# EAGLE schematic mcb-enhancer-v4 (EAGLE 6.3)
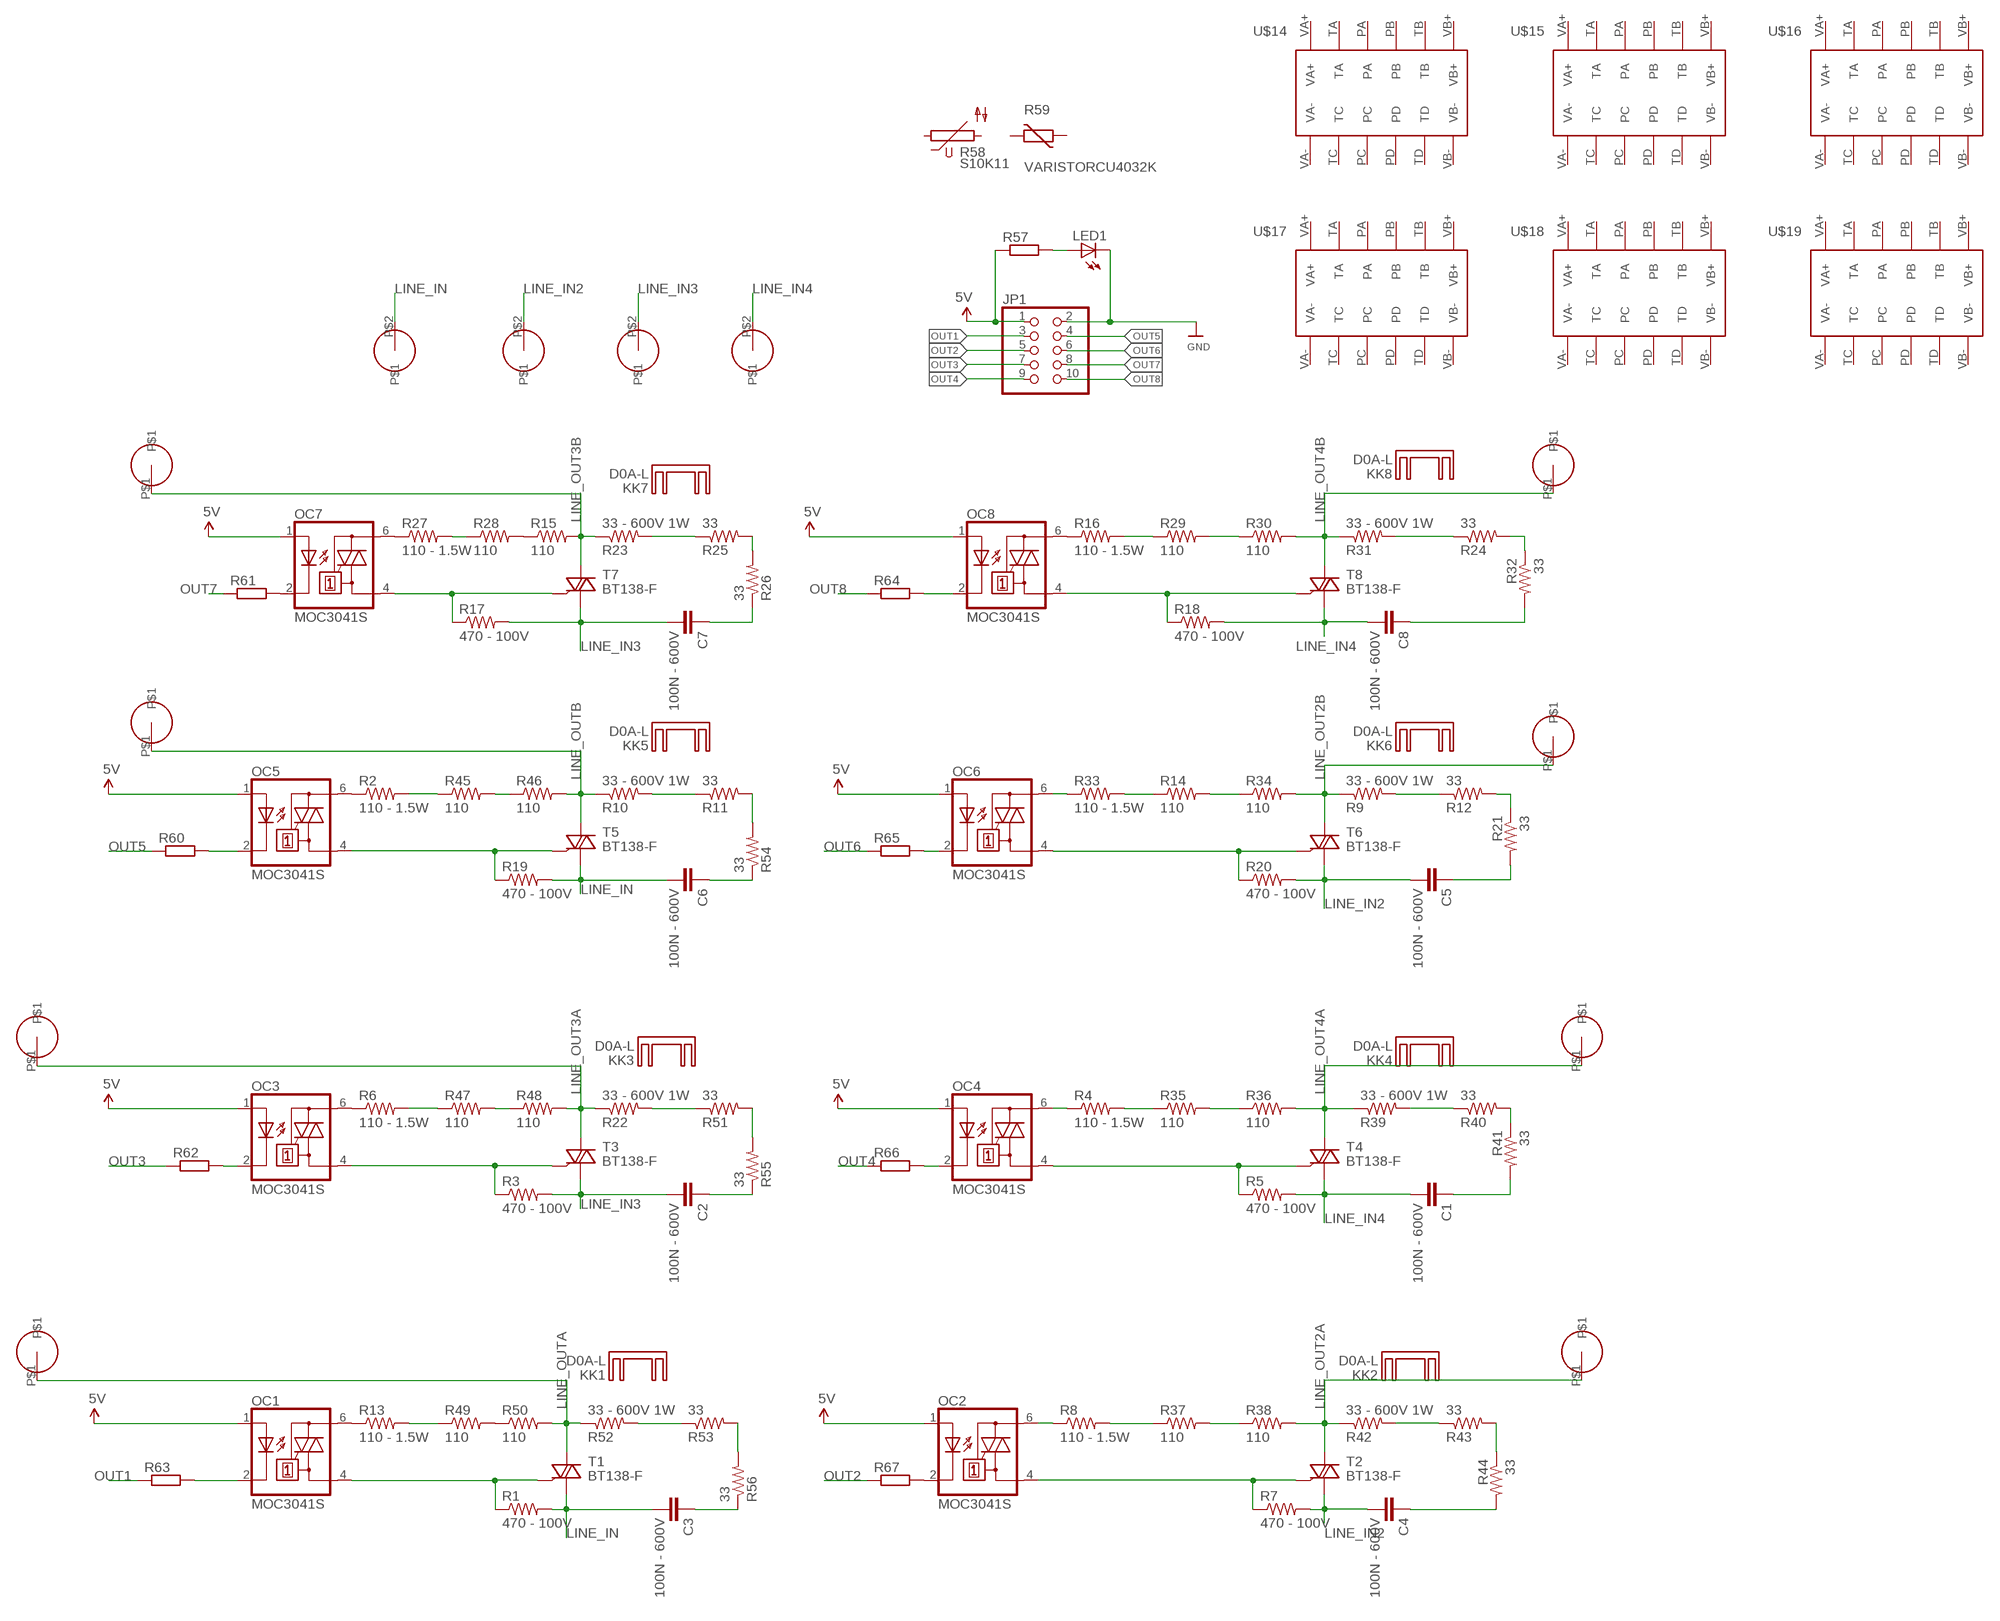
[diagram p0: schematic, sheet 1]

## Parts
C1  100N - 600V  C-EUC1210  [C1210]
C2  100N - 600V  C-EUC1210  [C1210]
C3  100N - 600V  C-EUC1210  [C1210]
C4  100N - 600V  C-EUC1210  [C1210]
C5  100N - 600V  C-EUC1210  [C1210]
C6  100N - 600V  C-EUC1210  [C1210]
C7  100N - 600V  C-EUC1210  [C1210]
C8  100N - 600V  C-EUC1210  [C1210]
JP1  PINHD-2X5  [2X05]
KK1  D0A-L  [D02A-L]
KK2  D0A-L  [D02A-L]
KK3  D0A-L  [D02A-L]
KK4  D0A-L  [D02A-L]
KK5  D0A-L  [D02A-L]
KK6  D0A-L  [D02A-L]
KK7  D0A-L  [D02A-L]
KK8  D0A-L  [D02A-L]
LED1  LEDCHIP-LED0805  [CHIP-LED0805]
OC1  MOC3041S  [DIL6-SMD]
OC2  MOC3041S  [DIL6-SMD]
OC3  MOC3041S  [DIL6-SMD]
OC4  MOC3041S  [DIL6-SMD]
OC5  MOC3041S  [DIL6-SMD]
OC6  MOC3041S  [DIL6-SMD]
OC7  MOC3041S  [DIL6-SMD]
OC8  MOC3041S  [DIL6-SMD]
R1  470 - 100V  R-US_R1206  [R1206]
R2  110 - 1.5W  R-US_R2512  [R2512]
R3  470 - 100V  R-US_R1206  [R1206]
R4  110 - 1.5W  R-US_R2512  [R2512]
R5  470 - 100V  R-US_R1206  [R1206]
R6  110 - 1.5W  R-US_R2512  [R2512]
R7  470 - 100V  R-US_R1206  [R1206]
R8  110 - 1.5W  R-US_R2512  [R2512]
R9  33 - 600V 1W  R-US_R1206  [R1206]
R10  33 - 600V 1W  R-US_R1206  [R1206]
R11  33  R-US_R1206  [R1206]
R12  33  R-US_R1206  [R1206]
R13  110 - 1.5W  R-US_R2512  [R2512]
R14  110  R-US_R2512  [R2512]
R15  110  R-US_R2512  [R2512]
R16  110 - 1.5W  R-US_R2512  [R2512]
R17  470 - 100V  R-US_R1206  [R1206]
R18  470 - 100V  R-US_R1206  [R1206]
R19  470 - 100V  R-US_R1206  [R1206]
R20  470 - 100V  R-US_R1206  [R1206]
R21  33  R-US_R1206  [R1206]
R22  33 - 600V 1W  R-US_R1206  [R1206]
R23  33 - 600V 1W  R-US_R1206  [R1206]
R24  33  R-US_R1206  [R1206]
R25  33  R-US_R1206  [R1206]
R26  33  R-US_R1206  [R1206]
R27  110 - 1.5W  R-US_R2512  [R2512]
R28  110  R-US_R2512  [R2512]
R29  110  R-US_R2512  [R2512]
R30  110  R-US_R2512  [R2512]
R31  33 - 600V 1W  R-US_R1206  [R1206]
R32  33  R-US_R1206  [R1206]
R33  110 - 1.5W  R-US_R2512  [R2512]
R34  110  R-US_R2512  [R2512]
R35  110  R-US_R2512  [R2512]
R36  110  R-US_R2512  [R2512]
R37  110  R-US_R2512  [R2512]
R38  110  R-US_R2512  [R2512]
R39  33 - 600V 1W  R-US_R1206  [R1206]
R40  33  R-US_R1206  [R1206]
R41  33  R-US_R1206  [R1206]
R42  33 - 600V 1W  R-US_R1206  [R1206]
R43  33  R-US_R1206  [R1206]
R44  33  R-US_R1206  [R1206]
R45  110  R-US_R2512  [R2512]
R46  110  R-US_R2512  [R2512]
R47  110  R-US_R2512  [R2512]
R48  110  R-US_R2512  [R2512]
R49  110  R-US_R2512  [R2512]
R50  110  R-US_R2512  [R2512]
R51  33  R-US_R1206  [R1206]
R52  33 - 600V 1W  R-US_R1206  [R1206]
R53  33  R-US_R1206  [R1206]
R54  33  R-US_R1206  [R1206]
R55  33  R-US_R1206  [R1206]
R56  33  R-US_R1206  [R1206]
R57  R-EU_R0402  [R0402]
R58  S10K11  [S10K11]
R59  VARISTORCU4032K  [CU4032K]
R60  R-EU_R0603  [R0603]
R61  R-EU_R0603  [R0603]
R62  R-EU_R0603  [R0603]
R63  R-EU_R0603  [R0603]
R64  R-EU_R0603  [R0603]
R65  R-EU_R0603  [R0603]
R66  R-EU_R0603  [R0603]
R67  R-EU_R0603  [R0603]
T1  BT138-F  [TO220BF]
T2  BT138-F  [TO220BF]
T3  BT138-F  [TO220BF]
T4  BT138-F  [TO220BF]
T5  BT138-F  [TO220BF]
T6  BT138-F  [TO220BF]
T7  BT138-F  [TO220BF]
T8  BT138-F  [TO220BF]
U$1  CONN-SCREW-MINI  [CONN-SCREW-MINI]
U$2  CONN-SCREW-MINI  [CONN-SCREW-MINI]
U$3  CONN-SCREW-MINI  [CONN-SCREW-MINI]
U$4  CONN-SCREW-MINI  [CONN-SCREW-MINI]
U$5  CONN-SCREW-MINI  [CONN-SCREW-MINI]
U$6  CONN-SCREW-MINI  [CONN-SCREW-MINI]
U$7  CONN-SCREW-MINI  [CONN-SCREW-MINI]
U$8  CONN-SCREW-MINI  [CONN-SCREW-MINI]
U$9  CONN  [HC617]
U$10  CONN  [HC617]
U$11  CONN  [HC617]
U$12  CONN  [HC617]
U$14  S4EB-5V  [S4EB-5V]
U$15  S4EB-5V  [S4EB-5V]
U$16  S4EB-5V  [S4EB-5V]
U$17  S4EB-5V  [S4EB-5V]
U$18  S4EB-5V  [S4EB-5V]
U$19  S4EB-5V  [S4EB-5V]

## Nets
5V: JP1.1 OC1.1(A) OC2.1(A) OC3.1(A) OC4.1(A) OC5.1(A) OC6.1(A) OC7.1(A) OC8.1(A) R57.1
GND: JP1.2 LED1.C
LINE_IN: C3.2 C6.2 R1.2 R19.2 T1.T1(A1) T5.T1(A1) U$9.P$2
LINE_IN2: C4.2 C5.2 R7.2 R20.2 T2.T1(A1) T6.T1(A1) U$10.P$2
LINE_IN3: C2.2 C7.2 R3.2 R17.2 T3.T1(A1) T7.T1(A1) U$11.P$2
LINE_IN4: C1.2 C8.2 R5.2 R18.2 T4.T1(A1) T8.T1(A1) U$12.P$2
LINE_OUT2A: R38.2 R42.1 T2.T2(A2) U$2.P$1
LINE_OUT2B: R9.1 R34.2 T6.T2(A2) U$6.P$1
LINE_OUT3A: R22.1 R48.2 T3.T2(A2) U$3.P$1
LINE_OUT3B: R15.2 R23.1 T7.T2(A2) U$7.P$1
LINE_OUT4A: R36.2 R39.1 T4.T2(A2) U$4.P$1
LINE_OUT4B: R30.2 R31.1 T8.T2(A2) U$8.P$1
LINE_OUTA: R50.2 R52.1 T1.T2(A2) U$1.P$1
LINE_OUTB: R10.1 R46.2 T5.T2(A2) U$5.P$1
N$1: OC5.6(A2) R2.1
N$2: OC2.6(A2) R8.1
N$3: OC3.4(A1) R3.1 T3.G
N$4: OC3.6(A2) R6.1
N$5: OC4.4(A1) R5.1 T4.G
N$6: OC1.2(C) R63.2
N$7: R9.2 R12.1
N$8: R49.2 R50.1
N$9: R52.2 R53.1
N$10: OC1.6(A2) R13.1
N$11: OC1.4(A1) R1.1 T1.G
N$12: R8.2 R37.1
N$13: OC2.4(A1) R7.1 T2.G
N$14: R45.2 R46.1
N$15: OC2.2(C) R67.2
N$16: R23.2 R25.1
N$17: R25.2 R26.2
N$18: OC3.2(C) R62.2
N$19: OC4.2(C) R66.2
N$20: C7.1 R26.1
N$21: R12.2 R21.1
N$22: OC7.2(C) R61.2
N$23: OC7.6(A2) R27.1
N$24: OC8.2(C) R64.2
N$25: R15.1 R28.2
N$26: R27.2 R28.1
N$27: OC5.2(C) R60.2
N$28: OC6.2(C) R65.2
N$29: R16.2 R29.1
N$30: OC7.4(A1) R17.1 T7.G
N$31: OC8.6(A2) R16.1
N$32: OC8.4(A1) R18.1 T8.G
N$33: R29.2 R30.1
N$34: R37.2 R38.1
N$35: OC5.4(A1) R19.1 T5.G
N$36: OC6.4(A1) R20.1 T6.G
N$37: C5.1 R21.2
N$38: OC4.6(A2) R4.1
N$39: C8.1 R32.2
N$40: R24.2 R32.1
N$41: R24.1 R31.2
N$42: R4.2 R35.1
N$43: R35.2 R36.1
N$44: OC6.6(A2) R33.1
N$45: R14.1 R33.2
N$46: R14.2 R34.1
N$47: R39.2 R40.1
N$48: C1.1 R41.2
N$49: R40.2 R41.1
N$50: C4.1 R44.2
N$51: R43.2 R44.1
N$52: R42.2 R43.1
N$53: R47.2 R48.1
N$54: R13.2 R49.1
N$55: R6.2 R47.1
N$56: R2.2 R45.1
N$57: R22.2 R51.1
N$58: R10.2 R11.1
N$59: C3.1 R56.1
N$60: R53.2 R56.2
N$61: C2.1 R55.1
N$62: R51.2 R55.2
N$63: C6.1 R54.1
N$64: R11.2 R54.2
N$65: LED1.A R57.2
OUT1: JP1.3 R63.1
OUT2: JP1.5 R67.1
OUT3: JP1.7 R62.1
OUT4: JP1.9 R66.1
OUT5: JP1.4 R60.1
OUT6: JP1.6 R65.1
OUT7: JP1.8 R61.1
OUT8: JP1.10 R64.1
Unconnected: R58.1 R58.2 R59.1 R59.2 U$14.PA U$14.PB U$14.PC U$14.PD U$14.TA U$14.TB U$14.TC U$14.TD U$14.VA+ U$14.VA- U$14.VB+ U$14.VB- U$15.PA U$15.PB U$15.PC U$15.PD U$15.TA U$15.TB U$15.TC U$15.TD U$15.VA+ U$15.VA- U$15.VB+ U$15.VB- U$16.PA U$16.PB U$16.PC U$16.PD U$16.TA U$16.TB U$16.TC U$16.TD U$16.VA+ U$16.VA- U$16.VB+ U$16.VB- U$17.PA U$17.PB U$17.PC U$17.PD U$17.TA U$17.TB U$17.TC U$17.TD U$17.VA+ U$17.VA- U$17.VB+ U$17.VB- U$18.PA U$18.PB U$18.PC U$18.PD U$18.TA U$18.TB U$18.TC U$18.TD U$18.VA+ U$18.VA- U$18.VB+ U$18.VB- U$19.PA U$19.PB U$19.PC U$19.PD U$19.TA U$19.TB U$19.TC U$19.TD U$19.VA+ U$19.VA- U$19.VB+ U$19.VB-

## Library data of the parts
C1-C8 = rcl:C-EU: CAPACITOR, European symbol
JP1 = pinhead:PINHD-2X5: PIN HEADER
KK1-KK8 = heatsink:D0A-L: HEATSINK distributor Schukat
LED1 = adafruit:LED: LED OSRAM: - CHIPLED LG R971, LG N971, LY N971, LG Q971, LY Q971, LO R971, LY R971 LH N974, LH R974 LS Q976, LO Q976, LY Q976 LO Q996 - Hyper CHIPLED LW Q18S LB Q993, LB Q99A, LB R99A - SideLED LS A670, LO A670, LY A670, LG A670, LP A670 LB A673, LV A673, LT A673, LW A673 LH A674 LY A675 LS A676, LA A676, LO A676, LY A676, LW A676 LS A679, LY A679, LG A679 - Hyper Micro SIDELED® LS Y876, LA Y876, LO Y876, LY Y876 LT Y87S - SmartLED LW L88C, LW L88S LB L89C, LB L89S, LG L890 LS L89K, LO L89K, LY L89K LS L896, LA L896, LO L896, LY L896 - TOPLED LS T670, LO T670, LY T670, LG T670, LP T670 LSG T670, LSP T670, LSY T670, LOP T670, LYG T670 LG T671, LOG T671, LSG T671 LB T673, LV T673, LT T673, LW T673 LH T674 LS T676, LA T676, LO T676, LY T676, LB T676, LH T676, LSB T676, LW T676 LB T67C, LV T67C, LT T67C, LS T67K, LO T67K, LY T67K, LW E67C LS E67B, LA E67B, LO E67B, LY E67B, LB E67C, LV E67C, LT E67C LW T67C LS T679, LY T679, LG T679 LS T770, LO T770, LY T770, LG T770, LP T770 LB T773, LV T773, LT T773, LW T773 LH T774 LS E675, LA E675, LY E675, LS T675 LS T776, LA T776, LO T776, LY T776, LB T776 LHGB T686 LT T68C, LB T68C - Hyper Mini TOPLED® LB M676 - Mini TOPLED Santana® LG M470 LS M47K, LO M47K, LY M47K Source: http://www.osram.convergy.de/
OC1-OC8 = optocoupler:MOC30*: 6-Pin DIP Zero-Cross Optoisolators Triac Driver Output (250/400 Volt Peak) Source: http://www.fairchildsemi.com/ds/MO/MOC3043-M.pdf; MF: FAIRCHILD SEMICONDUCTOR; MPN: MOC3033S-M; OC_FARNELL: unknown; OC_NEWARK: 05C2878
R1-R56 = rcl:R-US_: RESISTOR, American symbol
R57 = resistor:R-EU_: RESISTOR, European symbol
R58 = varistor:S10K11: VARISTOR
R59 = varistor:VARISTOR: VARISTOR
R60-R67 = rcl:R-EU_: RESISTOR, European symbol
T1-T8 = triac:BT138: TRIAC Source: http://www.semiconductors.philips.com BT138_SERIES_2.pdf
U$1-U$8 = bontor:CONN-SCREW-MINI
U$9-U$12 = bontor:CONN
U$14-U$19 = bontor:S4EB-5V